# Altium project 3phasedriver.PrjPCB
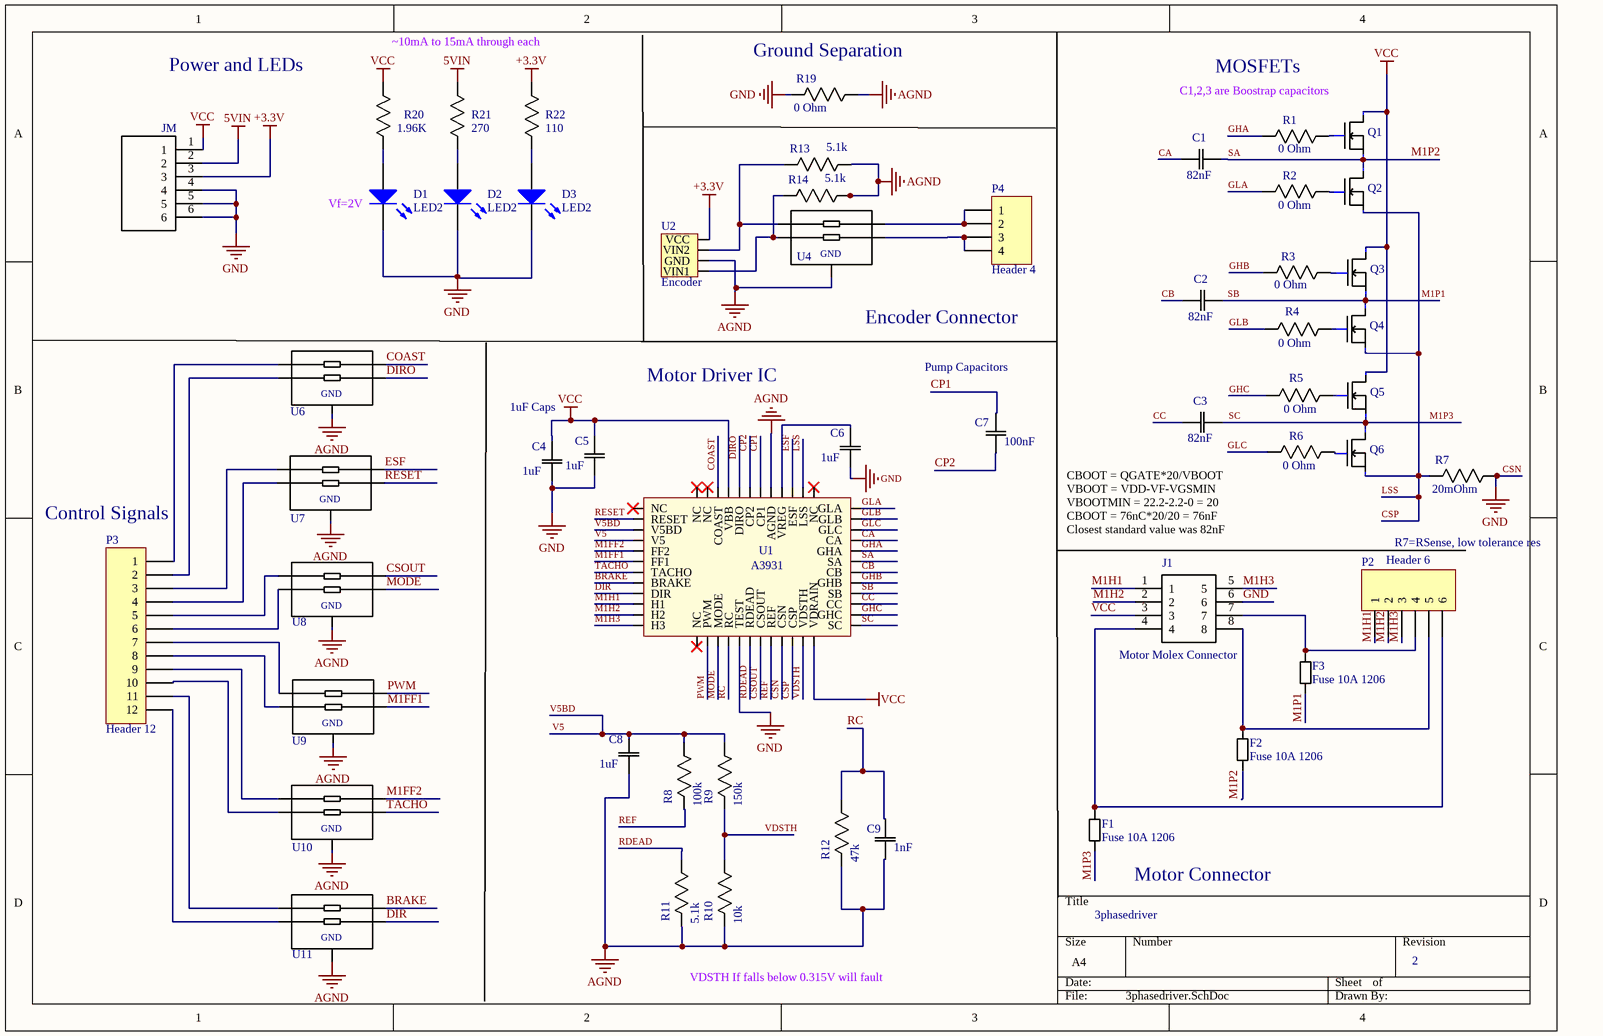
[diagram p0: 3phasedriver.SchDoc]
1 sheet, 53 parts. Net scope: global (net labels, ports and power ports of the same name join across sheets).
Board files: 3phasedriver.PcbDoc, 3phasedriver_rev2.PcbDoc

## Sheet 3phasedriver.SchDoc
size A4

### Parts
C1  82nF  [0805]
C2  82nF  [0805]
C3  82nF  [0805]
C4  1uF  [0805]
C5  1uF  [0805]
C6  1uF  [0805]
C7  100nF  [0805]
C8  1uF  [0805]
C9  1nF  [0805]
D1  LED2  [3.2X1.6X1.1]
D2  LED2  [3.2X1.6X1.1]
D3  LED2  [3.2X1.6X1.1]
F1  Fuse 10A 1206  [1206]
F2  Fuse 10A 1206  [1206]
F3  Fuse 10A 1206  [1206]
J1  Motor Molex Connector  [*MOLEX_0039281083]
JM  CONN HEADER VERT 6POS 3.96MM  [CONN HDR 6POS 3.96MM]  (value not drawn)
P2  Header 6  [HDR1X6]
P3  Header 12  [HDR1X12]
P4  Header 4  [HDR1X4]
Q1  N-Channel  [8-SOIC MOSFET]  (value not drawn)
Q2  N-Channel  [8-SOIC MOSFET]  (value not drawn)
Q3  N-Channel  [8-SOIC MOSFET]  (value not drawn)
Q4  N-Channel  [8-SOIC MOSFET]  (value not drawn)
Q5  N-Channel  [8-SOIC MOSFET]  (value not drawn)
Q6  N-Channel  [8-SOIC MOSFET]  (value not drawn)
R1  0 Ohm  [RESC2013X65N]
R2  0 Ohm  [RESC2013X65N]
R3  0 Ohm  [RESC2013X65N]
R4  0 Ohm  [RESC2013X65N]
R5  0 Ohm  [RESC2013X65N]
R6  0 Ohm  [RESC2013X65N]
R7  20mOhm  [0805]
R8  100k  [0805]
R9  150k  [0805]
R10  10k  [0805]
R11  5.1k  [0805]
R12  47k  [RESC2013X65N]
R13  5.1k  [0805]
R14  5.1k  [0805]
R19  0 Ohm  [RESC2013X65N]
R20  1.96K  [0805]
R21  270  [0805]
R22  110  [0805]
U1  A3931  [CQFP50P900X900X160-48N]
U2  Encoder  [EncoderConnector]
U4  EMI  [SOT-665]  (value not drawn)
U6  EMI  [SOT-665]  (value not drawn)
U7  EMI  [SOT-665]  (value not drawn)
U8  EMI  [SOT-665]  (value not drawn)
U9  EMI  [SOT-665]  (value not drawn)
U10  EMI  [SOT-665]  (value not drawn)
U11  EMI  [SOT-665]  (value not drawn)

### Nets
5VIN: JM.2 R21.1(R1)
+3.3V: JM.3 R22.1(R1) U2.VCC
AGND: C8.1(C1) C9.1(C1) R10.2(R2) R11.2(R2) R12.2(R2) R13.1(R1) R14.1(R1) R19.1(R1) U1.41(AGND) U2.GND U4.2(P$2) U6.2(P$2) U7.2(P$2) U8.2(P$2) U9.2(P$2) U10.2(P$2) U11.2(P$2)
CSN: C4.1(C1) C5.1(C1) C6.1(C1) D1.2(K) D2.2(K) D3.2(K) J1.6 JM.4 JM.5 JM.6 R7.1(R1) R19.2(R2) U1.17(TEST) U1.21(CSN)  [also labelled GND]
VCC: C4.2(C2) C5.2(C2) J1.3 JM.1 Q1.D Q3.D Q5.D R20.1(R1) U1.24(VDRAIN) U1.45(VBB)
BRAKE: U1.8(BRAKE) U11.1(P$1)
CA: C1.1(C1) U1.33(CA)
CB: C2.1(C1) U1.30(CB)
CC: C3.1(C1) U1.27(CC)
COAST: U1.46(COAST) U6.1(P$1)
CP1: C7.2(C2) U1.42(CP1)
CP2: C7.1(C1) U1.43(CP2)
CSOUT: U1.19(CSOUT) U8.1(P$1)
CSP: Q2.S Q4.S Q6.S R7.2(R2) U1.22(CSP) U1.38(LSS)  [also labelled LSS]
DIR: U1.9(DIR) U11.3(P$3)
DIRO: U1.44(DIRO) U6.3(P$3)
ESF: U1.39(ESF) U7.1(P$1)
GHA: R1.2(R2) U1.32(GHA)
GHB: R3.2(R2) U1.29(GHB)
GHC: R5.2(R2) U1.26(GHC)
GLA: R2.2(R2) U1.36(GLA)
GLB: R4.2(R2) U1.35(GLB)
GLC: R6.2(R2) U1.34(GLC)
M1FF1: U1.6(FF1) U9.3(P$3)
M1FF2: U1.5(FF2) U10.1(P$1)
M1H1: J1.1 P2.1 U1.10(H1)
M1H2: J1.2 P2.2 U1.11(H2)
M1H3: J1.5 P2.3 U1.12(H3)
M1P1: C2.2(C2) F3.1 Q3.S Q4.D U1.28(SB)  [also labelled SB]
M1P2: C1.2(C2) F2.1 Q1.S Q2.D U1.31(SA)  [also labelled SA]
M1P3: C3.2(C2) F1.1 Q5.S Q6.D U1.25(SC)  [also labelled SC]
MODE: U1.15(MODE) U8.3(P$3)
PWM: U1.14(PWM) U9.1(P$1)
RC: C9.2(C2) R12.1(R1) U1.16(RC)
RDEAD: R11.1(R1) U1.18(RDEAD)
REF: R8.2(R2) U1.20(REF)
RESET: U1.2(RESET) U7.3(P$3)
TACHO: U1.7(TACHO) U10.3(P$3)
V5: C8.2(C2) R8.1(R1) R9.1(R1) U1.3(V5BD) U1.4(V5)  [also labelled V5BD]
VDSTH: R9.2(R2) R10.1(R1) U1.23(VDSTH)
NetC6_2: C6.2(C2) U1.40(VREG)
NetD1_1: D1.1(A) R20.2(R2)
NetD2_1: D2.1(A) R21.2(R2)
NetD3_1: D3.1(A) R22.2(R2)
NetF1_2: F1.2 J1.4 P2.6
NetF2_2: F2.2 J1.8 P2.5
NetF3_2: F3.2 J1.7 P2.4
NetP3_1: P3.1 U6.5(P$5)
NetP3_2: P3.2 U6.4(P$4)
NetP3_3: P3.3 U7.5(P$5)
NetP3_4: P3.4 U7.4(P$4)
NetP3_5: P3.5 U8.5(P$5)
NetP3_6: P3.6 U8.4(P$4)
NetP3_7: P3.7 U9.5(P$5)
NetP3_8: P3.8 U9.4(P$4)
NetP3_9: P3.9 U10.5(P$5)
NetP3_10: P3.10 U10.4(P$4)
NetP3_11: P3.11 U11.5(P$5)
NetP3_12: P3.12 U11.4(P$4)
NetP4_1: P4.1 P4.2 U4.5(P$5)
NetP4_3: P4.3 P4.4 U4.4(P$4)
NetQ1_G: Q1.G R1.1(R1)
NetQ2_G: Q2.G R2.1(R1)
NetQ3_G: Q3.G R3.1(R1)
NetQ4_G: Q4.G R4.1(R1)
NetQ5_G: Q5.G R5.1(R1)
NetQ6_G: Q6.G R6.1(R1)
NetR13_2: R13.2(R2) U2.VIN2 U4.1(P$1)
NetR14_2: R14.2(R2) U2.VIN1 U4.3(P$3)

Not connected (* = marked no-connect by the designer): U1 1(NC)* 13(NC)* 37(NC)* 47(NC)* 48(NC)*

### Notes on the sheet
- ~10mA to 15mA through each
- Power and LEDs
- (near R19) Ground Separation
- (near Q1) C1,2,3 are Boostrap capacitors
- MOSFETs
- (near D1) Vf=2V
- Motor Driver IC
- Encoder Connector
- (near C7) Pump Capacitors
- 1uF Caps
- (near P3) Control Signals
- CBOOT = QGATE*20/VBOOT
  VBOOT = VDD-VF-VGSMIN
  VBOOTMIN = 22.2-2.2-0 = 20
  CBOOT = 76nC*20/20 = 76nF
  Closest standard value was 82nF
- R7=RSense, low tolerance res
- 3phasedriver
- (near F1) Motor Connector
- VDSTH If falls below 0.315V will fault
- 2
- (in symbol IP4256CZ5-W) GND

### Library data of the parts
C1-C3 = CAP 82nF 0805: 0.082µF ±5% 50V Ceramic Capacitor X7R 0805 (2012 Metric); MP: CC0805JRX7R9BB823; MF: Yageo; Package: 0805; Price: 0.223 CAD; Value: 82nF; Digikey: 311-4285-1-ND; Digikey Link: https://www.digikey.ca/product-detail/en/yageo/CC0805JRX7R9BB823/311-4285-1-ND/8025374; Tolerance: 5%; Rating: 50V
C4-C6 C8 = CAP 1uF 0805: CAP CER 1UF 50V X7R 0805; MP: CL21B105KBFNNNE; MF: Samsung Electro-Mechanics; Tolerance: 10%; Package: 0805; Price: 0,172 CAD; Value: 1uF; Digikey: 1276-1029-1-ND; Digikey Link: https://www.digikey.ca/product-detail/en/samsung-electro-mechanics/CL21B105KBFNNNE/1276-1029-1-ND/3889115; Rating: 50V
C7 = CAP 100nF 0805: CAP CER 0.1UF 50V X7R 0805; MP: CC0805KRX7R9BB104; MF: Yageo; Tolerance: 10%; Package: 0805; Price: 0,119 CAD; Value: 100nF; Digikey: 311-1140-1-ND; Digikey Link: https://www.digikey.ca/products/en?keywords=311-1140-1-ND; Rating: 50V
C9 = CAP 1nF 0805: CAP CER 1000PF 50V X7R 0805; MP: CC0805KRX7R9BB102; MF: Yageo; Tolerance: 10%; Package: 0805; Price: 0.1 CAD; Value: 1nF; Digikey: 311-1127-1-ND; Digikey Link: https://www.digikey.ca/products/en?keywords=311-1127-1-ND; Rating: 50V
D1-D3 = LED GREEN SMD: Typical RED, GREEN, YELLOW, AMBER GaAs LED; MF: Lite-On Inc.; MP: LTST-C191KGKT; Rating: 2V; Digikey: 160-1446-1-ND; Digikey Link: https://www.digikey.ca/products/en?keywords=160-1446-1-ND; Package: 0603
F1-F3 = Fuse 10A 1206: 10A 32V AC 63V DC Fuse Board Mount (Cartridge Style Excluded) Surface Mount 1206 (3216 Metric); MF: Schurter Inc.; MP: 3413.0328.22; Digikey: 486-1686-1-ND; Rating: 10A; Digikey Link: https://www.digikey.ca/products/en?keywords=486-1686-1-ND
J1 = Motor Molex: Connector Header Through Hole 8 position 0.165" (4.20mm); MP: 0039281083; MF: Molex; Digikey: WM3803-ND; Price: 1.624 CAD; Value: N/A; Digikey Link: https://www.digikey.ca/products/en?keywords=WM3803-ND
JM = CONN HEADER VERT 6POS 3.96MM: Connector Header Through Hole 6 position 0.156" (3.96mm); MF: TE Connectivity; MP: 1877285-6; Current Rating: 7.5A; Voltage Rating: 250VAC; SnapEDA_Link: https://www.snapeda.com/parts/1877285-6/TE%20Connectivity/view-part/2371244/?ref=snap; Digikey: https://www.digikey.ca/product-detail/en/te-connectivity-amp-connectors/1877285-6/A99849-ND/2000097; Digikey Link: A99849-ND
P2 = Header 6: Header, 6-Pin; LatestRevisionDate: 17-Jul-2002; LatestRevisionNote: Re-released for DXP Platform.; Publisher: Altium Limited
P3 = Header 12: Header, 12-Pin; LatestRevisionDate: 17-Jul-2002; LatestRevisionNote: Re-released for DXP Platform.; Publisher: Altium Limited
P4 = Header 4: Header, 4-Pin; LatestRevisionDate: 17-Jul-2002; LatestRevisionNote: Re-released for DXP Platform.; Publisher: Altium Limited
Q1-Q6 = Mosfet N Channel 8-SOIC: MOSFET N-CH 30V 18.5A 8-SOIC; MF: ON Semiconductor; MP: FDS8813NZ; Digikey: FDS8813NZCT-ND; Price: 1.727 CAD; Rating: 30V; Digikey Link: https://www.digikey.ca/product-detail/en/on-semiconductor/FDS8813NZ/FDS8813NZCT-ND/1626932; Package: 8-SOIC
R1-R6 R19 = RES 0 Ohm 0805: RES SMD 0 OHM JUMPER 1/8W 0805; MP: RC0805JR-070RL; MF: Yageo; Value: 0; Rating: 0.125W; Digikey: 311-0.0ARCT-ND; Price: 0.058 CAD; Package: 0805; Digikey Link: https://www.digikey.ca/products/en?keywords=311-0.0ARCT-ND
R7 = RES 20mOhm 0805: RES 0.02 OHM 1% 1/2W 0805; MP: ERJ-6BWFR020V; MF: Panasonic Electronic Components; Rating: 0.5W; Digikey: P.02AQCT-ND; Price: 0.088 CAD; Package: 0805; Value: 20mOhm; Digikey Link: https://www.digikey.ca/products/en?keywords=P.02AQCT-ND; Tolerance: 1%
R8 = RES 100k 0805: RES SMD 100K OHM 1% 1/8W 0805; MP: RC0805FR-07100KL; MF: Yageo; Rating: 0.125W; Digikey: 311-100KCRCT-ND; Price: 0.058 CAD; Package: 0805; Value: 100k; Digikey Link: https://www.digikey.ca/products/en?keywords=311-100KCRCT-ND; Tolerance: 1%
R9 = RES 150k 0805: RES SMD 150K OHM 1% 1/8W 0805; MP: RC0805FR-07150KL; MF: Yageo; Rating: 0.125W; Digikey: 311-150KCRCT-ND; Price: 0.061 CAD; Package: 0805; Value: 150k; Digikey Link: https://www.digikey.ca/products/en?keywords=311-150KCRCT-ND; Tolerance: 1%
R10 = RES 10k 0805: RES SMD 10K OHM 1% 1/8W 0805; MP: RC0805FR-0710KL; MF: Yageo; Rating: 0.125W; Digikey: 311-10.0KCRCT-ND; Price: 0.061 CAD; Package: 0805; Value: 10k; Digikey Link: https://www.digikey.ca/products/en?keywords=311-10.0KCRCT-ND; Tolerance: 1%
R11 R13 R14 = RES 5.1k 0805: RES SMD 5.1K OHM 1% 1/8W 0805; MP: RC0805FR-075K1L; MF: Yageo; Rating: 0.125W; Digikey: 311-5.10KCRDKR-ND; Price: 0.061 CAD; Package: 0805; Value: 5.1k; Digikey Link: https://www.digikey.ca/products/en?keywords=311-5.10KCRDKR-ND; Tolerance: 1%
R12 = RC0805FR-072K2L: 47 kOhms ±1% 0.125W, 1/8W Chip Resistor 0805 (2012 Metric) Moisture Resistant Thick Film; MP: RC0805FR-0747KL; MF: Yageo; Price: 0.061 CAD; Package: 0805 (2012 Metric); Value: 47k; Digikey: 311-47.0KCRCT-ND; Digikey Link: https://www.digikey.ca/product-detail/en/yageo/RC0805FR-0747KL/311-47.0KCRCT-ND/730920
R20 = RES 1.96k 0805: RES SMD 1.96K OHM 1% 1/8W 0805; MP: ERJ-6ENF1961V; MF: Panasonic Electronic Components; Rating: 0.125W; Digikey: P1.96KCCT-ND; Price: 0.15 CAD; Package: 0805; Value: 1.96k; Digikey Link: https://www.digikey.ca/product-detail/en/panasonic-electronic-components/ERJ-6ENF1961V/P1.96KCCT-ND/119041; Tolerance: 1%
R21 = RES 270 0805: RES SMD 270 OHM 5% 1/8W 0805; MP: RC0805JR-07270RL; MF: Yageo; Rating: 0.125W; Digikey: 311-270ARCT-ND; Price: 0.054 CAD; Package: 0805; Value: 270; Digikey Link: https://www.digikey.ca/product-detail/en/yageo/RC0805JR-07270RL/311-270ARCT-ND/731238
R22 = RES 110 0805: RES SMD 110 OHM 1% 1/8W 0805; MP: RC0805FR-07110RL; MF: Yageo; Rating: 0.125W; Digikey: 311-110CRCT-ND; Price: 0.15 CAD; Package: 0805; Value: 110; Digikey Link: https://www.digikey.ca/product-detail/en/yageo/RC0805FR-07110RL/311-110CRCT-ND/730506; Tolerance: 1%
U1 = MotorDriver A3931: IC MOTOR DRIVER 5.5V-50V 48LQFP; MF: Allegro MicroSystems; MP: A3931KJPTR-T; Rating: 5.5V ~ 50V; Digikey: 620-1290-1-ND; Price: 8.948 CAD; Digikey Link: https://www.digikey.com/product-detail/en/allegro-microsystems-llc/A3931KJPTR-T/620-1290-1-ND/2000021
U2 = Encoder Connector: CONN HEADER R/A 4POS 1.5MM; MF: JST Sales America Inc.; MP: S4B-ZR(LF)(SN); Rating: 1A; Digikey: 455-1671-ND; Digikey Link: https://www.digikey.ca/products/en?keywords=455-1671-ND; Price: 0.324 CAD; Package: N/A; Value: N/A
U4 U6-U11 = IP4256CZ5-W: RC (Pi) EMI Filter 2nd Order Low Pass 2 Channel R = 100Ohms, C = 19pF (Total)  SOT-665; MF: Nexperia USA Inc.; MP: IP4256CZ5-W,115; SnapEDA_Link: https://www.snapeda.com/parts/IP4256CZ5-W/Nexperia%20USA%20Inc./view-part/3605439/?ref=snap; Price: 0.17 CAD; Package: SOT-665; Digikey: 1727-4718-1-ND; Digikey Link: https://www.digikey.ca/product-detail/en/nexperia-usa-inc/IP4256CZ5-W115/1727-4718-1-ND/2531158